# Altium schematic sheet lora.SchDoc
size A4; SheetNumber: 8; SheetTotal: 10
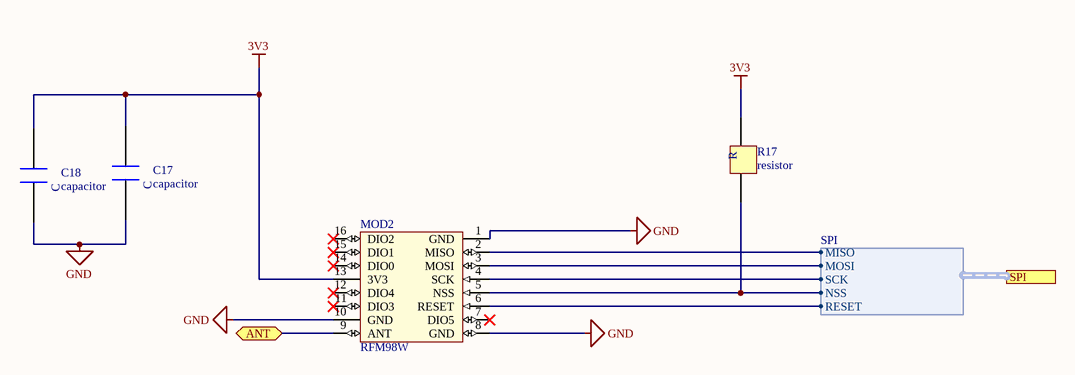
[diagram p0: lora.SchDoc]

## Parts
C17  capacitor  [CAPC1005X04L]
C18  capacitor  [CAPC1005X04L]
MOD2  RFM98W
R17  resistor  [CAPC1005X04L]

## Ports
ANT (bidir), SPI (harness SPI)

## Harnesses
SPI: MISO, MOSI, SCK, NSS, RESET

## Nets
3V3: C17.1 C18.1 MOD2.13(3V3) R17.1
GND: C17.2 C18.2 MOD2.1(GND) MOD2.8(GND) MOD2.10(GND)
ANT: MOD2.9(ANT) ; port ANT
NetMOD2_2: MOD2.2(MISO) ; port SPI.MISO
NetMOD2_3: MOD2.3(MOSI) ; port SPI.MOSI
NetMOD2_4: MOD2.4(SCK) ; port SPI.SCK
NetMOD2_5: MOD2.5(NSS) R17.2 ; port SPI.NSS
NetMOD2_6: MOD2.6(RESET) ; port SPI.RESET

Not connected (* = marked no-connect by the designer): MOD2 7(DIO5)* 11(DIO3)* 12(DIO4)* 14(DIO0)* 15(DIO1)* 16(DIO2)*

## Notes on the sheet
- (in symbol capacitor) C
- (in symbol resistor) R